# Altium schematic sheet Fonte.SchDoc
size A4
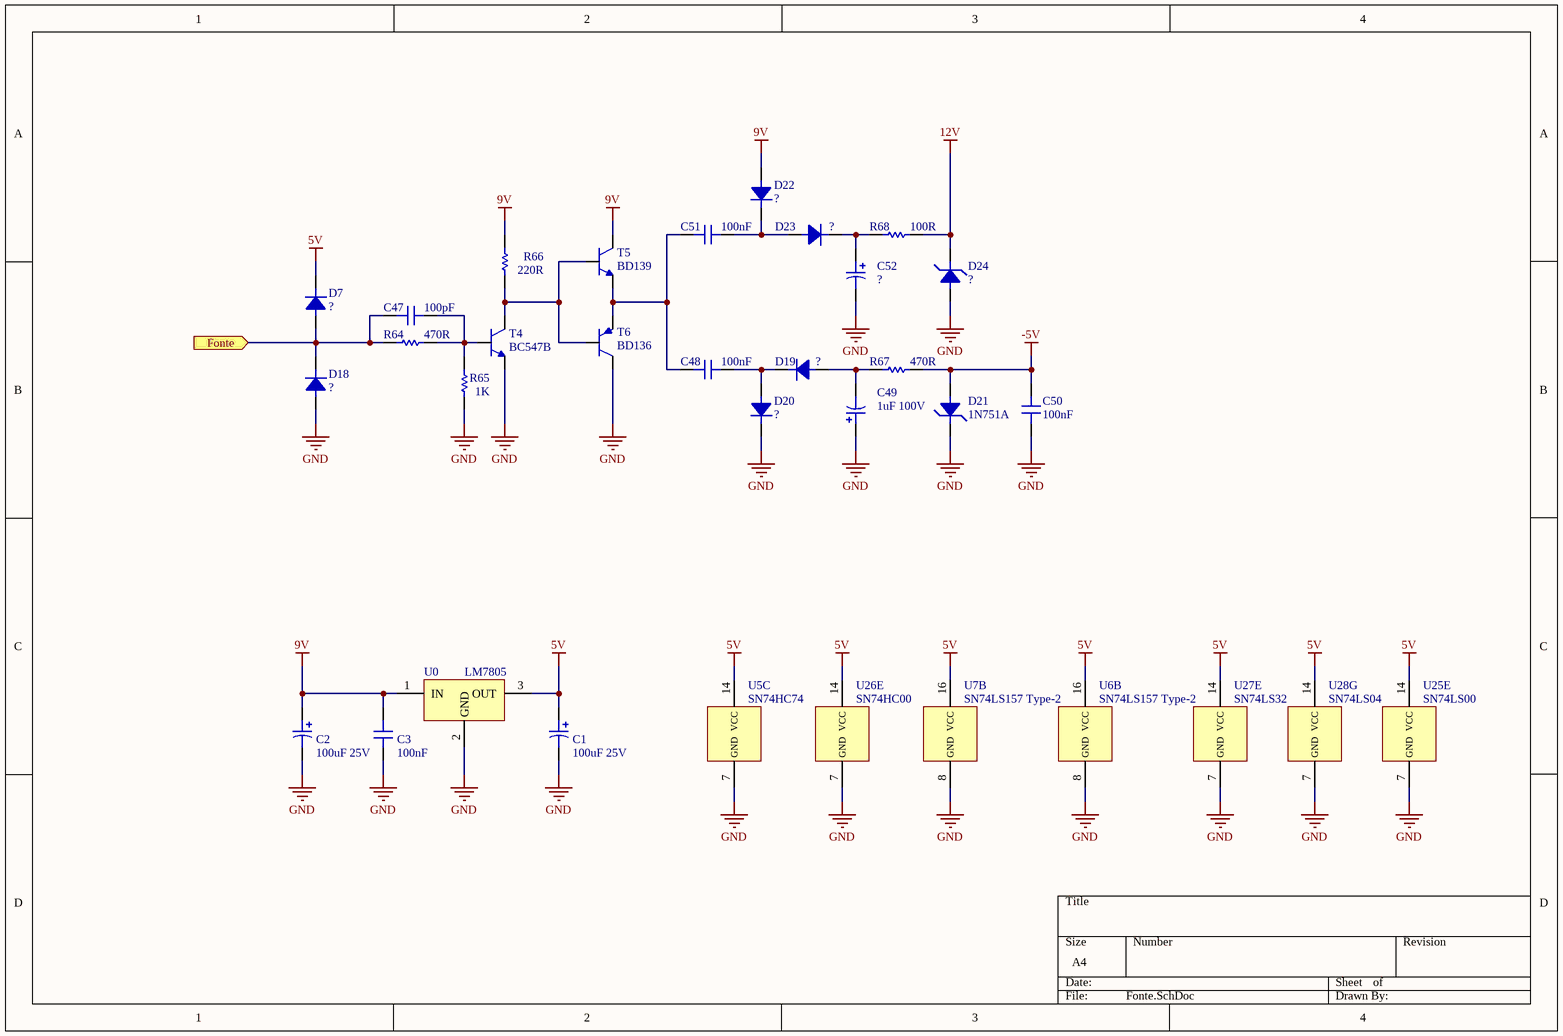
[diagram p0: Fonte.SchDoc]

## Parts
C1  100uF 25V  [ECA 6.3x11.2]
C2  100uF 25V  [ECA 6.3x11.2]
C3  100nF  [DiskCapacitor]
C47  100pF  [DiskCapacitor]
C48  100nF  [DiskCapacitor]
C49  1uF 100V  [ECA 5x11]
C50  100nF  [DiskCapacitor]
C51  100nF  [DiskCapacitor]
C52  ?  [ECA 5x11]
D7  ?  [DO-15]
D18  ?  [DO-15]
D19  ?  [DO-15]
D20  ?  [DO-15]
D21  1N751A  [DO-15]
D22  ?  [DO-15]
D23  ?  [DO-15]
D24  ?  [DO-15]
R64  470R  [CR25]
R65  1K  [CR25]
R66  220R  [CR25]
R67  470R  [CR25]
R68  100R  [CR25]
T4  BC547B  [TO-92]
T5  BD139  [TO-126]
T6  BD136  [TO-126]
U0  LM7805  [TO-220]
U5  SN74HC74  [TSSOP14]  (part C of 3)
U6  SN74LS157 Type-2  [TSSOP16]  (part B of 2)
U7  SN74LS157 Type-2  [TSSOP16]  (part B of 2)
U25  SN74LS00  [TSSOP14]  (part E of 5)
U26  SN74HC00  [TSSOP14]  (part E of 5)
U27  SN74LS32  [TSSOP14]  (part E of 5)
U28  SN74LS04  [CDIP14]  (part G of 7)

## Ports
Fonte (in)

## Nets
5V: C1.1 D7.1 U0.3(OUT) U5.14(VCC) U6.16(VCC) U7.16(VCC) U25.14(VCC) U26.14(VCC) U27.14(VCC) U28.14(VCC)
9V: C2.1 C3.2 D22.2 R66.2 T5.2 U0.1(IN)
12V: D24.1 R68.1
-5V: C50.1 D21.2 R67.1
GND: C1.2 C2.2 C3.1 C49.1 C50.2 C52.2 D18.2 D20.1 D21.1 D24.2 R65.1 T4.1 T6.2 U0.2(GND) U5.7(GND) U6.8(GND) U7.8(GND) U25.7(GND) U26.7(GND) U27.7(GND) U28.7(GND)
Fonte: C47.2 D7.2 D18.1 R64.2 ; port Fonte
NetC47_1: C47.1 R64.1 R65.2 T4.2
NetC48_1: C48.1 D19.1 D20.2
NetC48_2: C48.2 C51.2 T5.1 T6.1
NetC49_2: C49.2 D19.2 R67.2
NetC51_1: C51.1 D22.1 D23.2
NetC52_1: C52.1 D23.1 R68.2
NetR66_1: R66.1 T4.3 T5.3 T6.3

## Library data of the parts
C1 C2 = ECA1EM101
C3 C47 C48 C50 C51 = Capacitor
C49 = ECA2AM2R2
C52 = ECA1CM100
D7 D18-D20 D22 D23 = Diode
D21 = Diode Zener: 5V1 500mW
D24 = Diode Zener
R64-R68 = Resistor
T4 = BC546_47_48_49_50: NPN Epitaxial Silicon Transistor
T5 = BD135_37_39: NPN Epitaxial Silicon Transistor
T6 = BD136_38_40: PNP Epitaxial Silicon Transistor
U0 = LM7805: LM7805 - Positive Voltage Regulator
U5 = SN74HC74: Dual D-Type Positive-Edge-Triggered Flip-Flops With Clear and Preset
U6 U7 = SN74HC157 Type-2: Quadruple 2-Line To 1-Line Data Selectors/Mutiplexers
U25 U26 = SN74HC00: Quadruple 2-Input Positive-NAND Gates
U27 = SN74HC32: Quadruple 2-Input Positive-OR Gates
U28 = SN74HC04: Hex Inverters